# Altium schematic sheet MAX3232.SchDoc
size A4
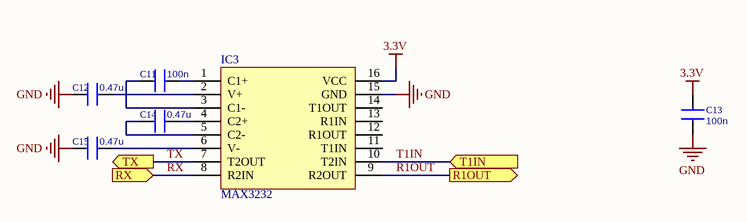
[diagram p0: MAX3232.SchDoc]

## Parts
C11  100n  [C_0805]
C12  0.47u  [C_0805]
C13  100n  [C_0805]
C14  0.47u  [C_0805]
C15  0.47u  [C_0805]
IC3  MAX3232  [SSOP-16]

## Ports
R1OUT (out), RX (in), T1IN (in), TX (out)

## Nets
3.3V: C13.2 IC3.16(VCC)
GND: C12.1 C13.1 C15.1 IC3.15(GND)
R1OUT: IC3.9(R2OUT) ; port R1OUT
RX: IC3.8(R2IN) ; port RX
T1IN: IC3.10(T2IN) ; port T1IN
TX: IC3.7(T2OUT) ; port TX
NetC11_1: C11.1 IC3.3(C1-)
NetC11_2: C11.2 IC3.1(C1+)
NetC12_2: C12.2 IC3.2(V+)
NetC14_1: C14.1 IC3.5(C2-)
NetC14_2: C14.2 IC3.4(C2+)
NetC15_2: C15.2 IC3.6(V-)

Not connected (* = marked no-connect by the designer): IC3 11(T1IN) 12(R1OUT) 13(R1IN) 14(T1OUT)

## Library data of the parts
C11-C15 = C0805: Capacitor
  C11 C13: Value: 100n
  C12 C14 C15: Value: 0.47u
IC3 = MAX3232: RS-232 Line Driver/Receiver With ±15-kV ESD Protection